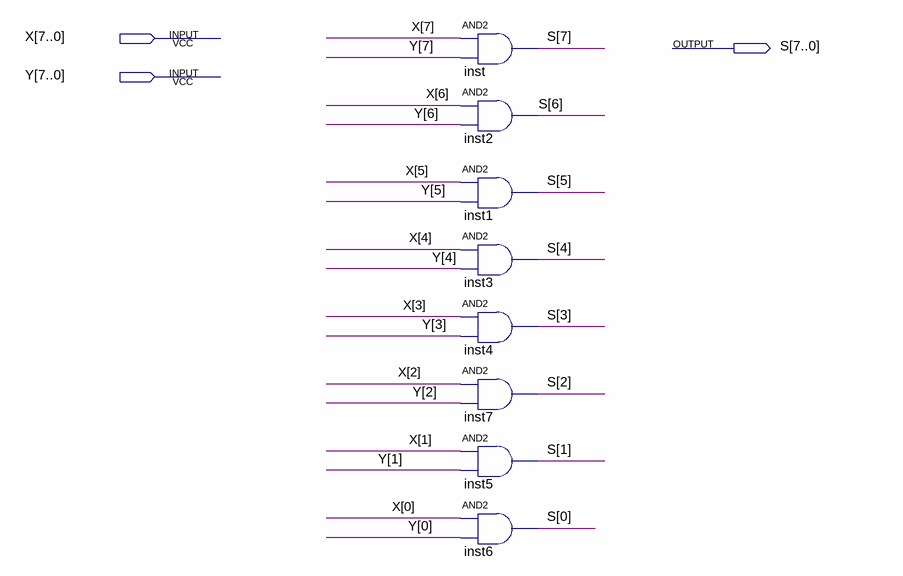
[diagram p0: schematic sheet]
// Quartus schematic and8bits.bdf as structural Verilog: 8 symbols, 3 pins
module and8bits (
  input  [7:0] X,
  input  [7:0] Y,
  output [7:0] S
);

  and inst (S[7], X[7], Y[7]);
  and inst2 (S[6], X[6], Y[6]);
  and inst1 (S[5], X[5], Y[5]);
  and inst3 (S[4], X[4], Y[4]);
  and inst4 (S[3], X[3], Y[3]);
  and inst7 (S[2], X[2], Y[2]);
  and inst5 (S[1], X[1], Y[1]);
  and inst6 (S[0], X[0], Y[0]);
endmodule
